# EAGLE design ESP12_Dev (EAGLE 7.2.0)
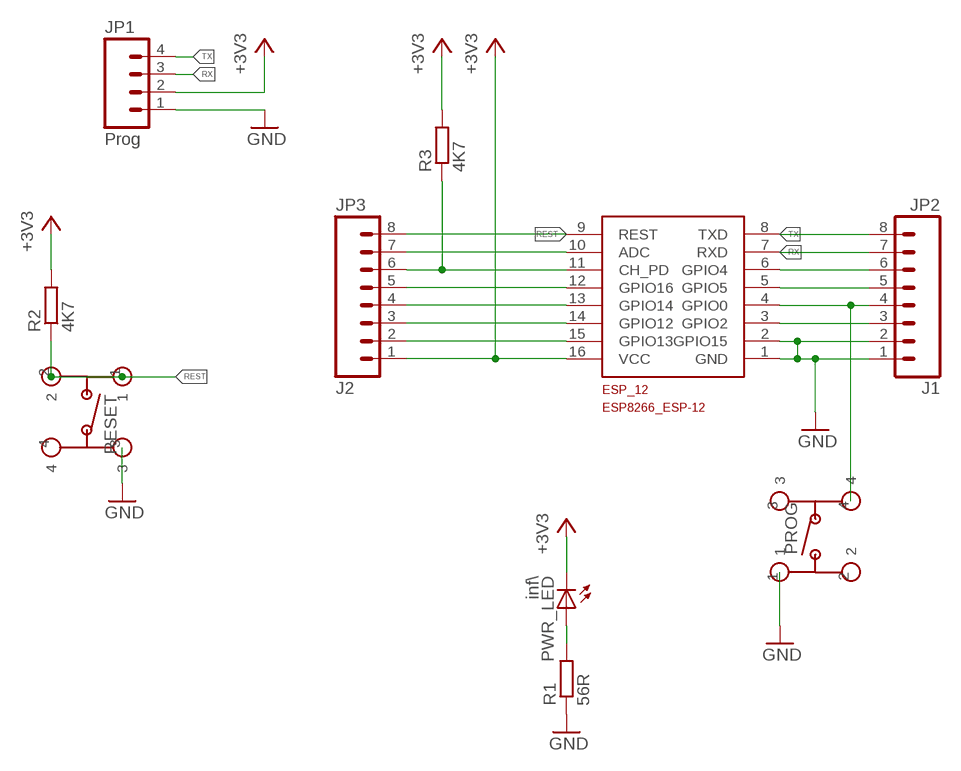
[diagram p0: schematic, sheet 1]

## Parts
ESP_12  ESP8266_ESP-12  [ESP8266-ESP12]
JP1  Prog  M04LOCK  [1X04_LOCK]
JP2  J1  M08LOCK  [1X08_LOCK]
JP3  J2  M08LOCK  [1X08_LOCK]
PROG  TACTILE-SWITCH-SMD  [TACTILE-SWITCH-SMD]
PWR_LED  inf\  LEDCHIPLED_0805  [CHIPLED_0805]
R1  56R  R-EU_R0805  [R0805]
R2  4K7  R-EU_R0805  [R0805]
R3  4K7  R-EU_R0805  [R0805]
RESET  TACTILE-SWITCH-SMD  [TACTILE-SWITCH-SMD]

## Nets
+3V3: ESP_12.16(VCC) JP1.2 JP3.1 PWR_LED.C R2.2 R3.2
ADC: ESP_12.10(ADC) JP3.7
CH_PD: ESP_12.11(CH_PD) JP3.6 R3.1
GND: ESP_12.1(GND) ESP_12.2(GPIO15) JP1.1 JP2.1 JP2.2 PROG.1 R1.1 RESET.3
GPIO0: ESP_12.4(GPIO0) JP2.4 PROG.4
GPIO2: ESP_12.3(GPIO2) JP2.3
GPIO4: ESP_12.6(GPIO4) JP2.6
GPIO5: ESP_12.5(GPIO5) JP2.5
GPIO12: ESP_12.14(GPIO12) JP3.3
GPIO13: ESP_12.15(GPIO13) JP3.2
GPIO14: ESP_12.13(GPIO14) JP3.4
GPIO16: ESP_12.12(GPIO16) JP3.5
N$1: PWR_LED.A R1.2
REST: ESP_12.9(REST) JP3.8 R2.1 RESET.1 RESET.2
RX: ESP_12.7(RXD) JP1.3 JP2.7
TX: ESP_12.8(TXD) JP1.4 JP2.8
Unconnected: PROG.2 PROG.3 RESET.4

## Library data of the parts
ESP_12 = ESP8266-ESP12:ESP8266_ESP-12
JP1 = SparkFun-Connectors:M04: Header 4 Standard 4-pin 0.1" header. Use with straight break away headers (SKU : PRT-00116), right angle break away headers (PRT-00553), swiss pins (PRT-00743), machine pins (PRT-00117), and female headers (PRT-00115). Molex polarized connector foot print use with SKU : PRT-08231 with associated crimp pins and housings. 1MM SMD Version SKU: PRT-10208
JP2 JP3 = SparkFun-Connectors:M08: Header 8 Standard 8-pin 0.1" header. Use with straight break away headers (SKU : PRT-00116), right angle break away headers (PRT-00553), swiss pins (PRT-00743), machine pins (PRT-00117), and female headers (PRT-00115).
PROG RESET = Gwa's Parts:TACTILE-SWITCH-SMD
PWR_LED = led:LED: LED OSRAM: - CHIPLED LG R971, LG N971, LY N971, LG Q971, LY Q971, LO R971, LY R971 LH N974, LH R974 LS Q976, LO Q976, LY Q976 LO Q996 - Hyper CHIPLED LW Q18S LB Q993, LB Q99A, LB R99A - SideLED LS A670, LO A670, LY A670, LG A670, LP A670 LB A673, LV A673, LT A673, LW A673 LH A674 LY A675 LS A676, LA A676, LO A676, LY A676, LW A676 LS A679, LY A679, LG A679 - Hyper Micro SIDELED® LS Y876, LA Y876, LO Y876, LY Y876 LT Y87S - SmartLED LW L88C, LW L88S LB L89C, LB L89S, LG L890 LS L89K, LO L89K, LY L89K LS L896, LA L896, LO L896, LY L896 - TOPLED LS T670, LO T670, LY T670, LG T670, LP T670 LSG T670, LSP T670, LSY T670, LOP T670, LYG T670 LG T671, LOG T671, LSG T671 LB T673, LV T673, LT T673, LW T673 LH T674 LS T676, LA T676, LO T676, LY T676, LB T676, LH T676, LSB T676, LW T676 LB T67C, LV T67C, LT T67C, LS T67K, LO T67K, LY T67K, LW E67C LS E67B, LA E67B, LO E67B, LY E67B, LB E67C, LV E67C, LT E67C LW T67C LS T679, LY T679, LG T679 LS T770, LO T770, LY T770, LG T770, LP T770 LB T773, LV T773, LT T773, LW T773 LH T774 LS E675, LA E675, LY E675, LS T675 LS T776, LA T776, LO T776, LY T776, LB T776 LHGB T686 LT T68C, LB T68C - Hyper Mini TOPLED® LB M676 - Mini TOPLED Santana® LG M470 LS M47K, LO M47K, LY M47K Source: http://www.osram.convergy.de LUXEON: - LUMILED® LXK2-PW12-R00, LXK2-PW12-S00, LXK2-PW14-U00, LXK2-PW14-V00 LXK2-PM12-R00, LXK2-PM12-S00, LXK2-PM14-U00 LXK2-PE12-Q00, LXK2-PE12-R00, LXK2-PE12-S00, LXK2-PE14-T00, LXK2-PE14-U00 LXK2-PB12-K00, LXK2-PB12-L00, LXK2-PB12-M00, LXK2-PB14-N00, LXK2-PB14-P00, LXK2-PB14-Q00 LXK2-PR12-L00, LXK2-PR12-M00, LXK2-PR14-Q00, LXK2-PR14-R00 LXK2-PD12-Q00, LXK2-PD12-R00, LXK2-PD12-S00 LXK2-PH12-R00, LXK2-PH12-S00 LXK2-PL12-P00, LXK2-PL12-Q00, LXK2-PL12-R00 Source: www.luxeon.com KINGBRIGHT: KA-3528ASYC Source: www.kingbright.com
R1-R3 = resistor:R-EU_: RESISTOR, European symbol

## Board
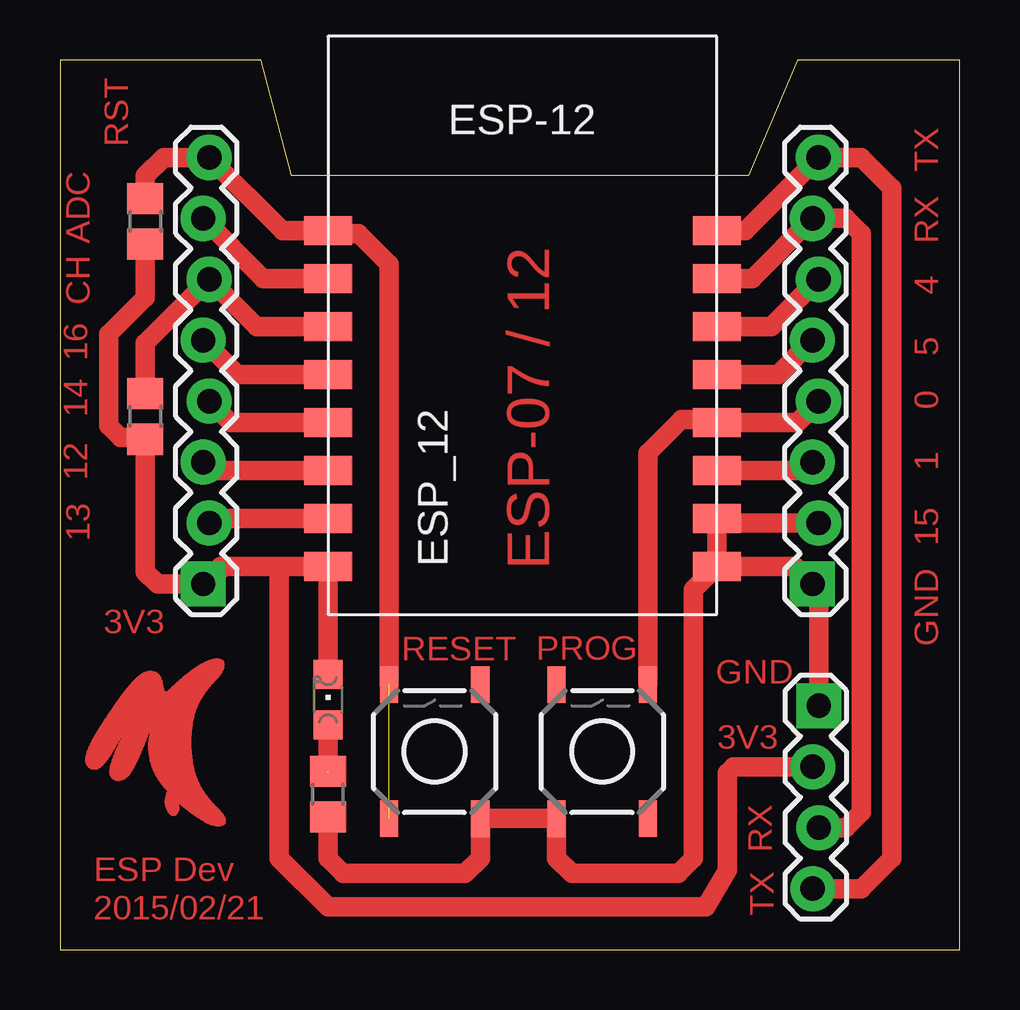
[diagram p1: board, top side]

Size 37.52 x 37.08 mm. Coordinates in mm from the lower left corner, seen from the top.
Outline: 0,0 37.52,0 37.52,37.07 30.73,37.08 28.7,32.26 9.65,32.26 8.38,37.08 0,37.07 0,0
Copper layers (1*16): Top 0.035mm / dielectric 1.5mm / Bottom 0.035mm
Design rules "default": minimum track width 10mil, minimum drill 24mil, track to track 8mil, track to pad 8mil, pad to pad 8mil, via to via 8mil, smd to smd 8mil, copper to edge 40mil, drill to drill 8mil, minimum pad ring 10mil, minimum via ring 8mil, stop-mask expansion 4mil, vias tented up to drill 0mil, thermal gap 10mil

### Footprints (pad centres in the part's own frame; a part is rotated, then mirrored left to right if it is on the bottom)
ESP8266-ESP12 = smd 2 x 1.2: 1 16.2,2; 2 16.2,4; 3 16.2,6; 4 16.2,8; 5 16.2,10; 6 16.2,12; 7 16.2,14; 8 16.2,16; 9 0,16; 10 0,14; 11 0,12; 12 0,10; 13 0,8; 14 0,6; 15 0,4; 16 0,2
1X04_LOCK = drill 1.016 pad 1.88 square: 1 0,0.127 | drill 1.016 pad 1.88: 2 2.54,-0.127; 3 5.08,0.127; 4 7.62,-0.127
1X08_LOCK = drill 1.016 pad 1.88 square: 1 0,0.127 | drill 1.016 pad 1.88: 2 2.54,-0.127; 3 5.08,0.127; 4 7.62,-0.127; 5 10.16,0.127; 6 12.7,-0.127; 7 15.24,0.127; 8 17.78,-0.127
TACTILE-SWITCH-SMD = smd 1.524 x 0.762: 1 -2.794,1.905; 2 2.794,1.905; 3 -2.794,-1.905; 4 2.794,-1.905
CHIPLED_0805 = smd 1.2 x 1.2: A 0,-1.05; C 0,1.05
R0805 = smd 1.3 x 1.5: 1 -0.95,0; 2 0.95,0

### Placement (x,y rotation side)
ESP_12  11.18,13.97 0 top
JP1  31.51,10.16 270 top
JP2  31.5,15.24 90 top
JP3  6.1,15.24 90 top
PROG  22.61,8.25 90 top
PWR_LED  11.18,10.41 0 top
R1  11.18,6.48 90 top
R2  3.56,30.35 270 top
R3  3.56,22.22 270 top
RESET  15.62,8.25 90 top
U$1  [GWAJA-LOGO]  6.91,5.14 90 top

### Tracks (layer width: path | path; a pad name or v marks a point on that pad's centre or on a via)
+3V3
  Top 0: R3.2 3.56,21.34
  Top 0.813: 8.89,15.97 ESP_12.16 PWR_LED.C | 8.89,15.97 6.7,15.97 | 6.7,15.97 JP3.1 | 6.7,15.97 6.7,15.84 6.1,15.24 4.06,15.24 3.56,15.75 R3.2 | 8.89,15.97 9.14,15.72 9.14,3.81 11.18,1.78 26.92,1.78 27.81,3.3 27.81,7.37 28.07,7.62 JP1.2 | 3.56,21.34 2.54,21.34 2.03,21.84 2.03,25.65 3.56,27.18 R2.2
ADC
  Top 0.813: ESP_12.10 8.48,27.97 JP3.7
CH_PD
  Top 0.813: ESP_12.11 8.19,25.97 JP3.6 3.56,25.27 R3.1
GND
  Top 0.813: R1.1 11.18,3.81 11.81,3.18 16.89,3.18 17.53,3.81 RESET.3 PROG.1 20.7,3.81 21.34,3.18 25.78,3.18 26.42,3.81 26.42,15.01 ESP_12.1 | ESP_12.1 30.64,15.97 JP2.1 31.64,14.97 JP1.1 | ESP_12.1 ESP_12.2 27.38,17.78 JP2.2
GPIO0
  Top 0.813: PROG.4 24.51,20.7 25.91,22.1 27.25,22.1 ESP_12.4 30.73,21.97 JP2.4
GPIO2
  Top 0.813: ESP_12.3 31.02,19.97 JP2.3
GPIO4
  Top 0.813: ESP_12.6 29.65,25.97 JP2.6
GPIO5
  Top 0.813: ESP_12.5 29.94,23.97 JP2.5
GPIO12
  Top 0.813: ESP_12.14 6.32,19.97 JP3.3
GPIO13
  Top 0.813: ESP_12.15 6.41,17.97 JP3.2
GPIO14
  Top 0.813: ESP_12.13 7.11,21.97 JP3.4
GPIO16
  Top 0.813: ESP_12.12 7.4,23.97 JP3.5
N$1  (1 unrouted)
  Top 0.813: PWR_LED.A 11.18,7.37
REST  (1 unrouted)
  Top 0.813: RESET.2 13.72,28.57 12.45,29.85 11.3,29.85 ESP_12.9 9.27,29.97 JP3.8 4.32,33.02 3.56,32.26 R2.1
RX
  Top 0.813: ESP_12.7 28.86,27.97 JP2.7 32.77,30.48 33.4,29.85 33.4,5.71 32.77,5.08 JP1.3
TX
  Top 0.813: ESP_12.8 28.57,29.97 JP2.8 33.4,33.02 34.67,31.75 34.67,3.81 33.4,2.54 JP1.4

### Text on the board
Top: RST | TX | RX | ADC | 4 | CH | 5 | 16 | 0 | 14 | 1 | 12 | 15 | 13 | ESP-07 / 12 | GND | 3V3 | RESET | PROG | GND | 3V3 | RX | ESP Dev | TX | 2015/02/21